# Altium schematic sheet LEM.SchDoc: QUTMS - HVBoard V1.1 - LEM
size A3; Author: Jonn Dillon; Organization: QUT Motorsport; Address1: O-120; Address2: O Block; Address3: QUT Gardens Point; Address4: Brisbane, 4000; DocumentNumber: 3; Revision: 3; SheetNumber: 3; SheetTotal: 8
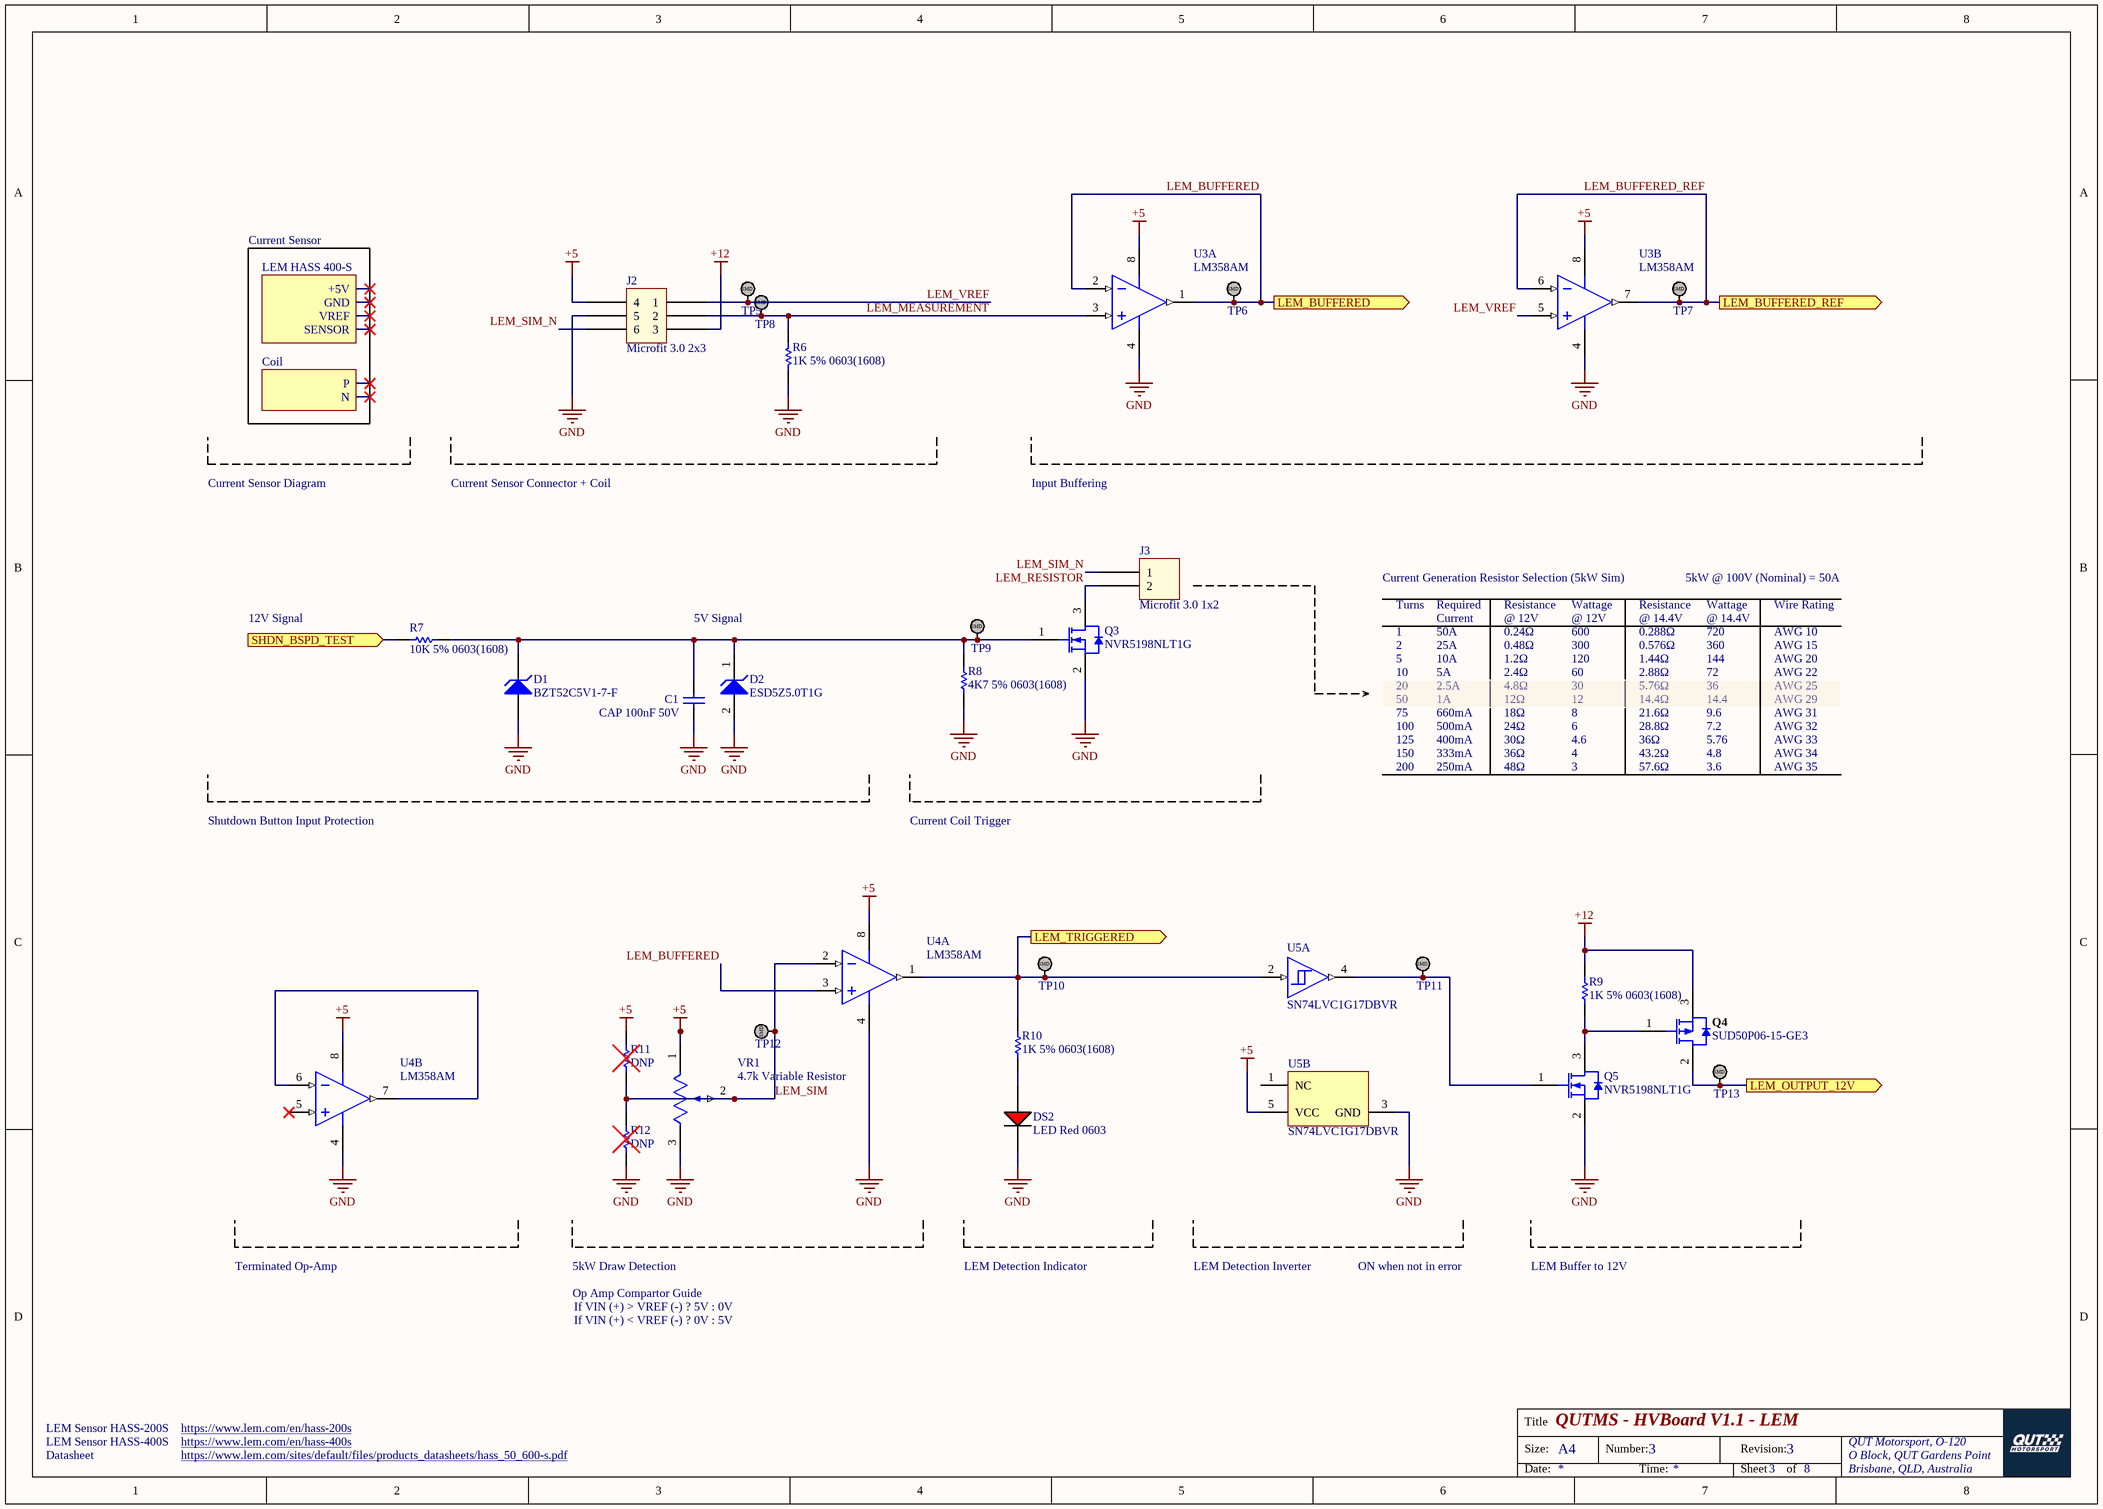
[diagram p0: LEM.SchDoc]

## Parts
C1  CAP 100nF 50V  [CAPC0603(1608)100_L]
D1  BZT52C5V1-7-F  [DIOD-SOD123_V]
D2  ESD5Z5.0T1G  [ONSC-SOD-523-2-502-01_V]
DS2  LED Red 0603  [LED RED 0603]
J2  Microfit 3.0 2x3  [Microfit_2X3_R_TH]
J3  Microfit 3.0 1x2  [Microfit_1X2_R_TH]
Q3  NVR5198NLT1G  [ONSC-SOT-23-3-318-08_V]
Q4  SUD50P06-15-GE3  [VSIL-TO-252AA-3_V]
Q5  NVR5198NLT1G  [ONSC-SOT-23-3-318-08_V]
R6  1K 5% 0603(1608)  [RESC0603(1608)_L]
R7  10K 5% 0603(1608)  [RESC0603(1608)_N]
R8  4K7 5% 0603(1608)  [RESC0603(1608)_N]
R9  1K 5% 0603(1608)  [RESC0603(1608)_L]
R10  1K 5% 0603(1608)  [RESC0603(1608)_L]
R11  DNP  [RESC0603(1608)_L]
R12  DNP  [RESC0603(1608)_L]
TP5  TestPoint_SMD  [TestPointSMD]  (value not drawn)
TP6  TestPoint_SMD  [TestPointSMD]  (value not drawn)
TP7  TestPoint_SMD  [TestPointSMD]  (value not drawn)
TP8  TestPoint_SMD  [TestPointSMD]  (value not drawn)
TP9  TestPoint_SMD  [TestPointSMD]  (value not drawn)
TP10  TestPoint_SMD  [TestPointSMD]  (value not drawn)
TP11  TestPoint_SMD  [TestPointSMD]  (value not drawn)
TP12  TestPoint_SMD  [TestPointSMD]  (value not drawn)
TP13  TestPoint_SMD  [TestPointSMD]  (value not drawn)
U3  LM358AM  [D0008A_N]  (parts A,B of 2)
U4  LM358AM  [D0008A_N]  (parts A,B of 2)
U5  SN74LVC1G17DBVR  [DBV0005A_L]  (parts A,B of 2)
VR1  4.7k Variable Resistor  [VG039NCHXTB472]

## Ports
LEM_BUFFERED (out), LEM_BUFFERED_REF (out), LEM_OUTPUT_12V (out), LEM_TRIGGERED (out), SHDN_BSPD_TEST (in)

## Nets
+5: J2.4 R11.2 U3.8(V+) U4.8(V+) U5.5(VCC) VR1.1
+12: J2.3 Q4.3(S) R9.2
GND: C1.2 D1.1(A) D2.2(A) DS2.2(C) J2.5 Q3.2(S) Q5.2(S) R6.1 R8.1 R12.1 U3.4(GND) U4.4(GND) U5.3(GND) VR1.3
LEM_BUFFERED: TP6.1 U3.1(OUTA) U3.2(INA-) U4.3(INA+) ; port LEM_BUFFERED
LEM_BUFFERED_REF: TP7.1 U3.6(INB-) U3.7(OUTB) ; port LEM_BUFFERED_REF
LEM_MEASUREMENT: J2.2 R6.2 TP8.1 U3.3(INA+)
LEM_OUTPUT_12V: Q4.2(D) TP13.1 ; port LEM_OUTPUT_12V
LEM_RESISTOR: J3.2 Q3.3(D)
LEM_SIM: R11.1 R12.2 TP12.1 U4.2(INA-) VR1.2
LEM_SIM_N: J2.6 J3.1
LEM_TRIGGERED: R10.2 TP10.1 U4.1(OUTA) U5.2(A) ; port LEM_TRIGGERED
LEM_VREF: J2.1 TP5.1 U3.5(INB+)
SHDN_BSPD_TEST: R7.2 ; port SHDN_BSPD_TEST
NetC1_1: C1.1 D1.2(K) D2.1(K) Q3.1(G) R7.1 R8.2 TP9.1
NetDS2_1: DS2.1(A) R10.1
NetQ4_1: Q4.1(G) Q5.3(D) R9.1
NetQ5_1: Q5.1(G) TP11.1 U5.4(Y)
NetU4_6: U4.6(INB-) U4.7(OUTB)

Not connected (* = marked no-connect by the designer): U4 5(INB+)*; U5 1(NC)

## Notes on the sheet
- Current Sensor
- LEM HASS 400-S
- +5V
- GND
- VREF
- Coil
- SENSOR
- P
- N
- Current Sensor Diagram
- Current Sensor Connector + Coil
- Input Buffering
- Current Generation Resistor Selection (5kW Sim)
- 5kW @ 100V (Nominal) = 50A
- 12V Signal
- 5V Signal
- Turns
- 1
- 2
- Required
- 50A
- 25A
- Current
- 0.24Ω
- Resistance
- @ 12V
- 0.48Ω
- 600
- Wattage
- 300
- @ 14.4V
- 0.288Ω
- 0.576Ω
- 720
- 360
- Wire Rating
- AWG 10
- AWG 15
- 5
- 10
- 20
- 50
- 75
- 10A
- 5A
- 2.5A
- 1A
- 660mA
- 1.2Ω
- 2.4Ω
- 4.8Ω
- 12Ω
- 18Ω
- 120
- 60
- 30
- 12
- 8
- 1.44Ω
- 2.88Ω
- 5.76Ω
- 14.4Ω
- 21.6Ω
- 144
- 72
- 36
- 14.4
- 9.6
- AWG 20
- AWG 22
- AWG 25
- AWG 29
- AWG 31
- 100
- 125
- 150
- 200
- 500mA
- 400mA
- 333mA
- 250mA
- 24Ω
- 30Ω
- 36Ω
- 48Ω
- 6
- 4.6
- 4
- 3
- 28.8Ω
- 43.2Ω
- 57.6Ω
- 7.2
- 5.76
- 4.8
- 3.6
- AWG 32
- AWG 33
- AWG 34
- AWG 35
- Shutdown Button Input Protection
- Current Coil Trigger
- Terminated Op-Amp
- 5kW Draw Detection
- Op Amp Compartor Guide
- If VIN (+) > VREF (-) ? 5V : 0V
- If VIN (+) < VREF (-) ? 0V : 5V
- LEM Detection Indicator
- LEM Detection Inverter
- ON when not in error
- LEM Buffer to 12V
- LEM Sensor HASS-400S
- Datasheet
- LEM Sensor HASS-200S
- https://www.lem.com/sites/default/files/products_datasheets/hass_50_600-s.pdf
- https://www.lem.com/en/hass-400s
- https://www.lem.com/en/hass-200s
- Title
- Size:
- A4
- Number:
- Revision:
- QUT Motorsport, O-120
- O Block, QUT Gardens Point
- Date:
- Time:
- Sheet
- of
- Brisbane, QLD, Australia
- (in symbol TestPoint_SMD) SMD

## Library data of the parts
C1 = CMP-1035-02591-1: CAP 100nF 50V ±5% 0603 (1608 Metric) Thickness 1mm SMD; Tolerance: Â±5%; Case-Metric: 1608; Case-EIA: 0603; Rated Voltage: 50 V; Max Thickness: 1 mm; Technology: SMT; Value: 100nF
D1 = CMP-2000-05976-1: Surface Mount Zener Diode, 5.1 V, -65 to 150 degC, 2-Pin SMD (SOD-123), RoHS, Tape and Reel; Manufacturer: DiodesIncorporated; Unit Weight: 0.000353oz; Zz - Zener Impedance: 60Ohms; Vz - Zener Voltage: 5.1V; Pd - Power Dissipation: 500mW; Zener Current: 5mA; Ir - Reverse Current: 2uA; Voltage Temperature Coefficient: -0.75mV/C; Configuration: Single; Voltage Tolerance: 6%; Height: 1.35mm; Width: 1.7mm; Minimum Operating Temperature: -65C; Series: BZT52C5; Package Description: 2-Pin Surface Mount Device, Body 2.7 x 1.55 mm; Length: 2.85mm; Mounting Technology: SurfaceMount; Brand: DiodesIncorporated; Factory Pack Quantity: 3000; Product Category: ZenerDiodes; RoHS: True; Manufacturer URL: http://www.diodes.com/; Termination Style: SMD/SMT; Package / Case: SOD-123; Packaging: Reel; Package Reference: SOD123; Datasheet Version: Rev. 37-2, 09/2012; Maximum Operating Temperature: +150C; Datasheet URL: http://www.diodes.com/_files/datasheets/ds18004.pdf; Mounting Style: SMD/SMT
D2 = CMP-1063-00102-1: Transient Voltage Suppressor, Micro-Packaged Diode for ESD Protection, 2-Pin SOD-523, Pb-Free, Tape and Reel; Manufacturer: On Semiconductor; V(BR) Min (V): 6.2; VRWM Max (V): 5; Number of Lines: 1; PPK Max (W): 174; IR Max (uA): 0.05; Direction: Unidirectional; PackageVersion: Rev. E, 09/2010; Mounting Technology: Surface Mount; Packing: Tape and Reel; ComponentLink2URL: http://www.onsemi.cn/pub_link/Collateral/ESD5Z2.5T1-D.PDF; ComponentLink2Description: Datasheet; PackageReference: SOD-523-2-502-01; ComponentLink1Description: Manufacturer URL; ComponentLink3URL: http://www.onsemi.com/pub_link/Collateral/502-01.PDF; PackageDescription: 2-Pin SOD, Body 1.2 x 0.8 mm; ComponentLink3Description: Package Specification; ComponentLink1URL: http://www.onsemi.com/; RoHS: Pb-Free; PartNumber: ESD5Z5.0T1G; DatasheetVersion: Rev. 10
J2 = Microfit_2x3
J3 = Microfit_1x2
Q3 Q5 = CMP-1058-00774-1: Power MOSFET, 60 V, 155 mOhm, Single N-Channel Logic Level, 3-Pin SOT-23, Pb-Free, Tape and Reel; Manufacturer: On Semiconductor; Ciss Typ (pF): 182; Coss Typ (pF): 25; ID Max (A): 2.2; Crss Typ (pF): 16; V(BR)DSS Min (V): 60; Qrr Typ (nC): 6; VGS Max (V): 20; VGS(th) Max (V): 2.5; Channel Polarity: N Channel; Package Type: SOT-23-3; ComponentLink1URL: http://www.onsemi.com/; ComponentLink2Description: Datasheet; ComponentLink1Description: Manufacturer URL; Mounting Technology: Surface Mount; Configuration: Single; Packing: Tape and Reel; RoHS: Pb-Free; ComponentLink3URL: http://www.onsemi.cn/pub_link/Collateral/318-08.PDF; PackageVersion: Rev. AP, 11/2009; PackageReference: SOT-23-3-318-08; DatasheetVersion: Rev. 1; PackageDescription: 3-Pin Small Outline Transistor, Body 2.92 x 1.3 mm, Pitch 0.95 mm; ComponentLink3Description: Package Specification; ComponentLink2URL: http://www.onsemi.com/pub_link/Collateral/NVR5198NL-D.PDF; PartNumber: NVR5198NLT1G
Q4 = CMP-2000-05431-1: P-Channel (D-S) MOSFET, 30 V, -55 to 150 degC, 3-Pin TO-252, RoHS, Tape and Reel; Manufacturer: Vishay; Unit Weight: 0.050717oz; Id - Continuous Drain Current: 50A; Rise Time: 70ns; Fall Time: 175ns; Configuration: Single; Rds On - Drain-Source Resistance: 15mOhms; Transistor Type: 1P-Channel; Channel Mode: Enhancement; Number of Channels: 1Channel; Typical Turn-On Delay Time: 15ns; Brand: VishaySemiconductors; Pd - Power Dissipation: 2.5W; Vds - Drain-Source Breakdown Voltage: -60V; Vgs - Gate-Source Voltage: 20V; Mounting Style: SMD/SMT; Package / Case: TO-252AA-3; Height: 2.39mm; Datasheet Version: Rev. C, 07/2013; Factory Pack Quantity: 2000; RoHS: True; Typical Turn-Off Delay Time: 175ns; Minimum Operating Temperature: -55C; Tradename: TrenchFET; Manufacturer URL: http://www.vishay.com/; Package Description: 3-Pin Surface Mount Device, Body 6.54 x 6.095 mm, Pitch 2.28 mm; Package Reference: TO-252; Transistor Polarity: P-Channel; Technology: Si; Series: SUD; Datasheet URL: https://datasheet.ciiva.com/4444/sud50p06-244530-4444327.pdf; Width: 6.22mm; Product Category: MOSFET; Packaging: Reel; Length: 6.73mm; Package URL: http://www.vishay.com/docs/89975/v15wl45c-m3.pdf; Maximum Operating Temperature: +150C
R6 R9 R10 = CMP-1012-00074-1: 1K 0.1W 5% 0603 (1608 Metric)  SMD; Case-EIA: 0603; Case-Metric: 1608; Value: 1000.00 Ohm; Technology: SMT; Tolerance: 5 %; Power: 0.1 W
R7 = CMP-1012-00098-1: 10K 0.1W 5% 0603 (1608 Metric)  SMD; Case-EIA: 0603; Value: 10000.00 Ohm; Case-Metric: 1608; Technology: SMT; Tolerance: 5 %; Power: 0.1 W
R8 = CMP-1012-00090-1: 4K7 0.1W 5% 0603 (1608 Metric)  SMD; Case-Metric: 1608; Value: 4700.00 Ohm; Case-EIA: 0603; Tolerance: 5 %; Technology: SMT; Power: 0.1 W
R11 R12 = CMP-1591-00001-1: 0603 (1608 Metric) Chip Resistor; Case-Metric: 1608; Case-EIA: 0603; PackageReference: RESC0603(1608)
U3 U4 = CMP-0055-00796-3: Low Power Dual Operational Amplifier, 8-pin Narrow SOIC; Manufacturer: Texas Instruments; CompType: Amplifiers; PackageTopMarking: NSZXTT*LM*358AM; PowerWise: N; Code_JEDEC: MS-012-AA; RoHS: N; PinCount: 8; Package Reference: D0008A; ComponentLink1Description: Datasheet URL; ComponentLink1URL: http://www.ti.com/general/docs/lit/getliterature.tsp?genericPartNumber=LM358-N&fileType=pdf; Code_IPC: SOIC127P600-8; PackageDescription: SOIC Narrow, 4.9 x 3.9 x 1.45mm, 8 Lead, 1.27mm Pitch
U5 = CMP-0859-00033-4: Single Schmitt-Trigger Buffer, DBV0005A, LARGE T&R; Manufacturer: Texas Instruments; Output Drive (IOL/IOH)(Max)(mA): 32/-32; Technology Family: LVC; ICC @ Nom Voltage(Max)(mA): 0.01; VCC(Min)(V): 1.65; F @ Nom Voltage(Max)(Mhz): 150; Schmitt Trigger: Yes; Voltage(Nom)(V): 1.8,2.5,3.3,5; 3-State Output: No; Bits(#): 1; VCC(Max)(V): 5.5; Input Type: CMOS/TTL; Logic: True; tpd @ Nom Voltage(Max)(ns): 11,6.5,5.5,5; Output Type: CMOS; Rating: Catalog; Sub-Family: Non-Inverting Buffer/Driver; PackageReference: DBV0005A; DatasheetVersion: SCES351V; Generic Part Number: SN74LVC1G17; Operating Temperature Range(C): -40 to 125,-40 to 85
VR1 = 4.7k Variable Resistor: 4k7 ±25% ±250 ppm/°C SMD Variable Resistors RoHS | VG039NCHXTB472; ComponentLink1Description: LCSC; ComponentLink1URL: https://lcsc.com/product-detail/Variable-Resistors_HDK-Hokuriku-Elec-Industry-VG039NCHXTB472_C128555.html